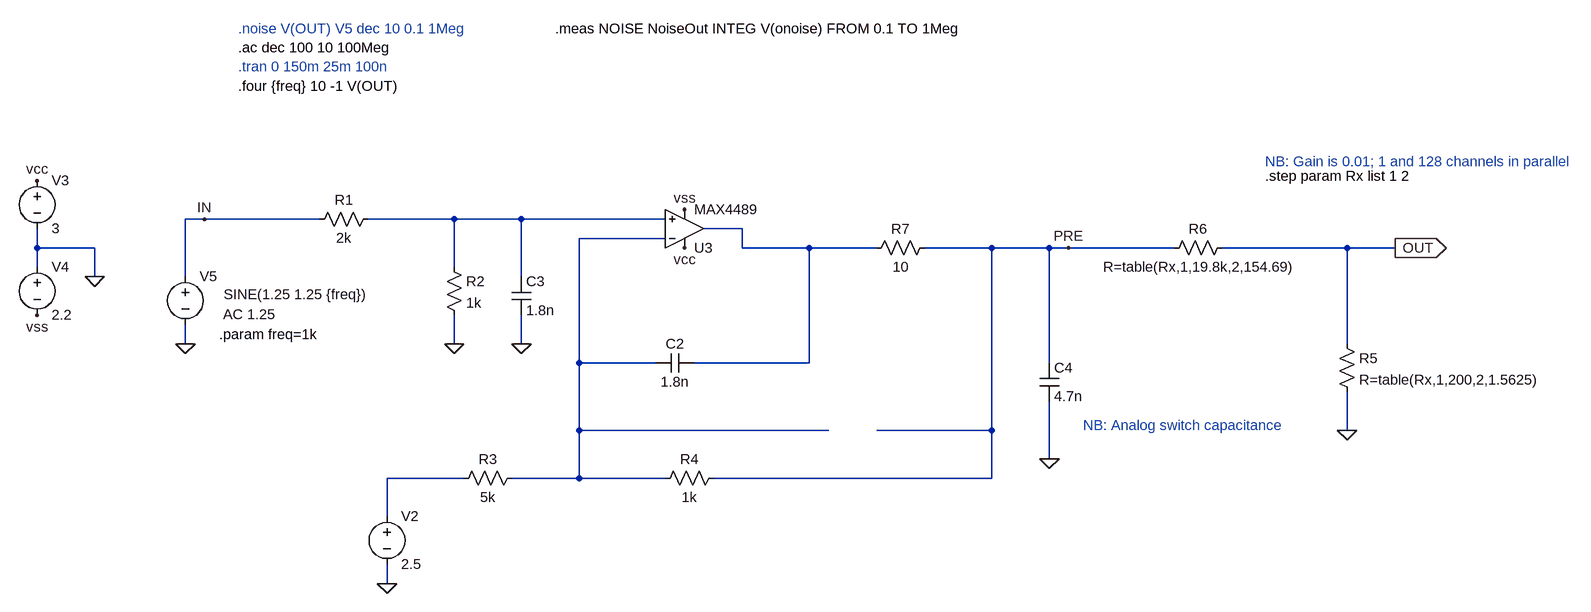
[diagram p0: schematic max4489_unipolar-to-bipolar.asc]
max4489_unipolar-to-bipolar.asc, the LTspice schematic file:
Version 4.1
SHEET 1 2300 1252
WIRE -96 128 -128 128
WIRE 96 128 -96 128
WIRE 320 128 176 128
WIRE 432 128 320 128
WIRE 672 128 432 128
WIRE 800 144 736 144
WIRE 672 160 528 160
WIRE -1200 176 -1200 144
WIRE -1104 176 -1200 176
WIRE 800 176 800 144
WIRE 912 176 800 176
WIRE 1024 176 912 176
WIRE 1216 176 1104 176
WIRE 1312 176 1216 176
WIRE 1344 176 1312 176
WIRE 1520 176 1344 176
WIRE 1808 176 1600 176
WIRE 1888 176 1808 176
WIRE -1200 208 -1200 176
WIRE 320 208 320 128
WIRE -1104 224 -1104 176
WIRE -128 224 -128 128
WIRE 432 224 432 128
WIRE -128 336 -128 304
WIRE 320 336 320 288
WIRE 432 336 432 288
WIRE 1808 336 1808 176
WIRE 528 368 528 160
WIRE 656 368 528 368
WIRE 912 368 912 176
WIRE 912 368 720 368
WIRE 1312 368 1312 176
WIRE 528 480 528 368
WIRE 944 480 528 480
WIRE 1216 480 1216 176
WIRE 1216 480 1024 480
WIRE 1808 480 1808 416
WIRE 1312 528 1312 432
WIRE 336 560 208 560
WIRE 528 560 528 480
WIRE 528 560 416 560
WIRE 672 560 528 560
WIRE 1216 560 1216 480
WIRE 1216 560 752 560
WIRE 208 624 208 560
WIRE 208 736 208 704
FLAG 208 736 0
FLAG -1104 224 0
FLAG -1200 288 vss
FLAG -1200 64 vcc
FLAG 320 336 0
FLAG -128 336 0
FLAG -96 128 IN
FLAG 704 112 vss
FLAG 704 176 vcc
FLAG 1344 176 PRE
FLAG 1808 480 0
FLAG 1888 176 OUT
IOPIN 1888 176 Out
FLAG 432 336 0
FLAG 1312 528 0
SYMBOL voltage 208 608 R0
WINDOW 123 0 0 Left 0
WINDOW 39 0 0 Left 0
SYMATTR InstName V2
SYMATTR Value 2.5
SYMBOL res 768 544 R90
WINDOW 0 0 56 VBottom 2
WINDOW 3 32 56 VTop 2
SYMATTR InstName R4
SYMATTR Value 1k
SYMBOL voltage -1200 48 R0
WINDOW 123 0 0 Left 0
WINDOW 39 0 0 Left 0
SYMATTR InstName V3
SYMATTR Value 3
SYMBOL voltage -1200 192 R0
WINDOW 123 0 0 Left 0
WINDOW 39 0 0 Left 0
SYMATTR InstName V4
SYMATTR Value 2.2
SYMBOL res 320 576 R270
WINDOW 0 32 56 VTop 2
WINDOW 3 0 56 VBottom 2
SYMATTR InstName R3
SYMATTR Value 5k
SYMBOL res 80 144 R270
WINDOW 0 32 56 VTop 2
WINDOW 3 0 56 VBottom 2
SYMATTR InstName R1
SYMATTR Value 2k
SYMBOL res 304 192 R0
SYMATTR InstName R2
SYMATTR Value 1k
SYMBOL voltage -128 208 R0
WINDOW 123 63 79 Left 2
WINDOW 39 0 0 Left 0
WINDOW 3 64 46 Left 2
SYMATTR Value2 AC 1.25
SYMATTR Value SINE(1.25 1.25 {freq})
SYMATTR InstName V5
SYMBOL res 1120 160 R90
WINDOW 0 0 56 VBottom 2
WINDOW 3 32 56 VTop 2
SYMATTR InstName R7
SYMATTR Value 10
SYMBOL cap 720 352 R90
WINDOW 0 0 32 VBottom 2
WINDOW 3 32 32 VTop 2
SYMATTR InstName C2
SYMATTR Value 1.8n
SYMBOL OpAmps\\MAX4489 704 208 M180
SYMATTR InstName U3
SYMBOL res 1792 320 R0
SYMATTR InstName R5
SYMATTR Value R=table(Rx,1,200,2,1.5625)
SYMBOL res 1616 160 R90
WINDOW 0 0 56 VBottom 2
WINDOW 3 32 56 VTop 2
SYMATTR InstName R6
SYMATTR Value R=table(Rx,1,19.8k,2,154.69)
SYMBOL cap 416 224 R0
SYMATTR InstName C3
SYMATTR Value 1.8n
SYMBOL cap 1296 368 R0
SYMATTR InstName C4
SYMATTR Value 4.7n
TEXT -40 -168 Left 2 !.ac dec 100 10 100Meg
TEXT -40 -136 Left 2 ;.tran 0 150m 25m 100n
TEXT -40 -104 Left 2 !.four {freq} 10 -1 V(OUT)
TEXT -72 320 Left 2 !.param freq=1k
TEXT -40 -200 Left 2 ;.noise V(OUT) V5 dec 10 0.1 1Meg
TEXT 1672 32 Left 2 ;NB: Gain is 0.01; 1 and 128 channels in parallel
TEXT 1672 56 Left 2 !.step param Rx list 1 2
TEXT 488 -200 Left 2 !.meas NOISE NoiseOut INTEG V(onoise) FROM 0.1 TO 1Meg
TEXT 1368 472 Left 2 ;NB: Analog switch capacitance

The netlist it stands for:
* max4489_unipolar-to-bipolar.asc
V2 N004 0 2.5
R4 PRE N003 1k
V3 vcc 0 3
V4 0 vss 2.2
R3 N004 N003 5k
R1 IN N001 2k
R2 N001 0 1k
V5 IN 0 SINE(1.25 1.25 {freq}) AC 1.25
R7 PRE N002 10
C2 N002 N003 1.8n
X§U3 N001 N003 vcc vss N002 MAX4489  ; pins In+ In- V+ V- OUT
R5 OUT 0 R=table(Rx,1,200,2,1.5625)
R6 OUT PRE R=table(Rx,1,19.8k,2,154.69)
C3 N001 0 1.8n
C4 PRE 0 4.7n
.ac dec 100 10 100Meg
* .tran 0 150m 25m 100n
.four {freq} 10 -1 V(OUT)
.param freq=1k
* .noise V(OUT) V5 dec 10 0.1 1Meg
* NB: Gain is 0.01; 1 and 128 channels in parallel
.step param Rx list 1 2
.meas NOISE NoiseOut INTEG V(onoise) FROM 0.1 TO 1Meg
* NB: Analog switch capacitance
.backanno
.end